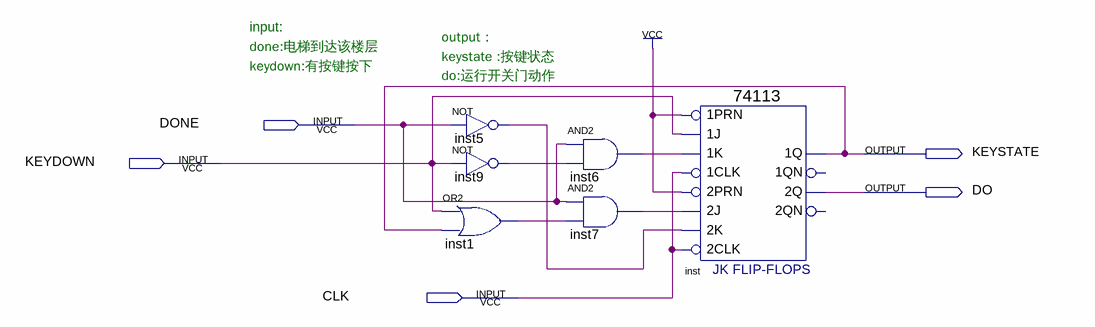
[diagram p0: schematic sheet]
// Quartus schematic keyinput.bdf as structural Verilog: 6 symbols, 5 pins
module keyinput (
  input  DONE,
  input  KEYDOWN,
  input  CLK,
  output KEYSTATE,
  output DO
);

  wire inst1_out, inst5_out, inst6_out, inst7_out, inst9_out;

  not inst5 (inst5_out, DONE);
  not inst9 (inst9_out, KEYDOWN);
  or inst1 (inst1_out, KEYDOWN, KEYSTATE);
  and inst6 (inst6_out, DONE, inst9_out);
  and inst7 (inst7_out, DONE, inst1_out);
  \74113  inst (
    .\1PRN (1'b1), .\2PRN (1'b1), .\1J (KEYDOWN), .\1K (inst6_out), .\1CLK (CLK), .\2J (inst7_out),
    .\2K (inst5_out), .\2CLK (CLK), .\1Q (KEYSTATE), .\2Q (DO));  // open: 1QN, 2QN

  // Notes on the sheet:
  //   input:
  //   output：
  //   done:电梯到达该楼层
  //   keystate :按键状态
  //   keydown:有按键按下
  //   do:运行开关门动作
endmodule
